# Altium schematic sheet [13]-BACKUP_POWER.SchDoc
size A4
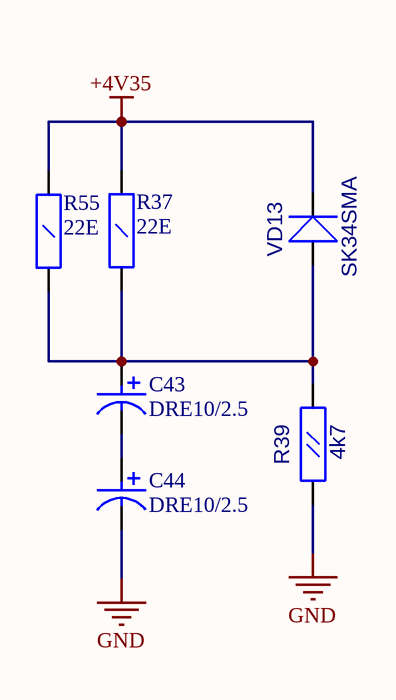
[diagram p0: [13]-BACKUP_POWER.SchDoc]

## Parts
C43  DRE10/2.5  [CAP_13x26]
C44  DRE10/2.5  [CAP_13x26]
R37  22E  [R2512]
R39  4k7  [RC0603]
R55  22E  [R2512]
VD13  SK34SMA  [SMA]

## Nets
+4V35: R37.2(B) R55.2(B) VD13.2(K)
GND: C44.1 R39.1(A)
NetC43_1: C43.1 C44.2
NetC43_2: C43.2 R37.1(A) R39.2(B) R55.1(A) VD13.1(A)

## Library data of the parts
C43 C44 = SUPERCAP_10F: Value: DRE10/2.5
R37 R55 = RC2512: Resistor 2512 1W; Value: 22E
R39 = RC0603: Value: 4k7
VD13 = SK34SMA: Schottky Rectifier; Value: {Value}